# Altium project uZed_Breakout.PrjPcb
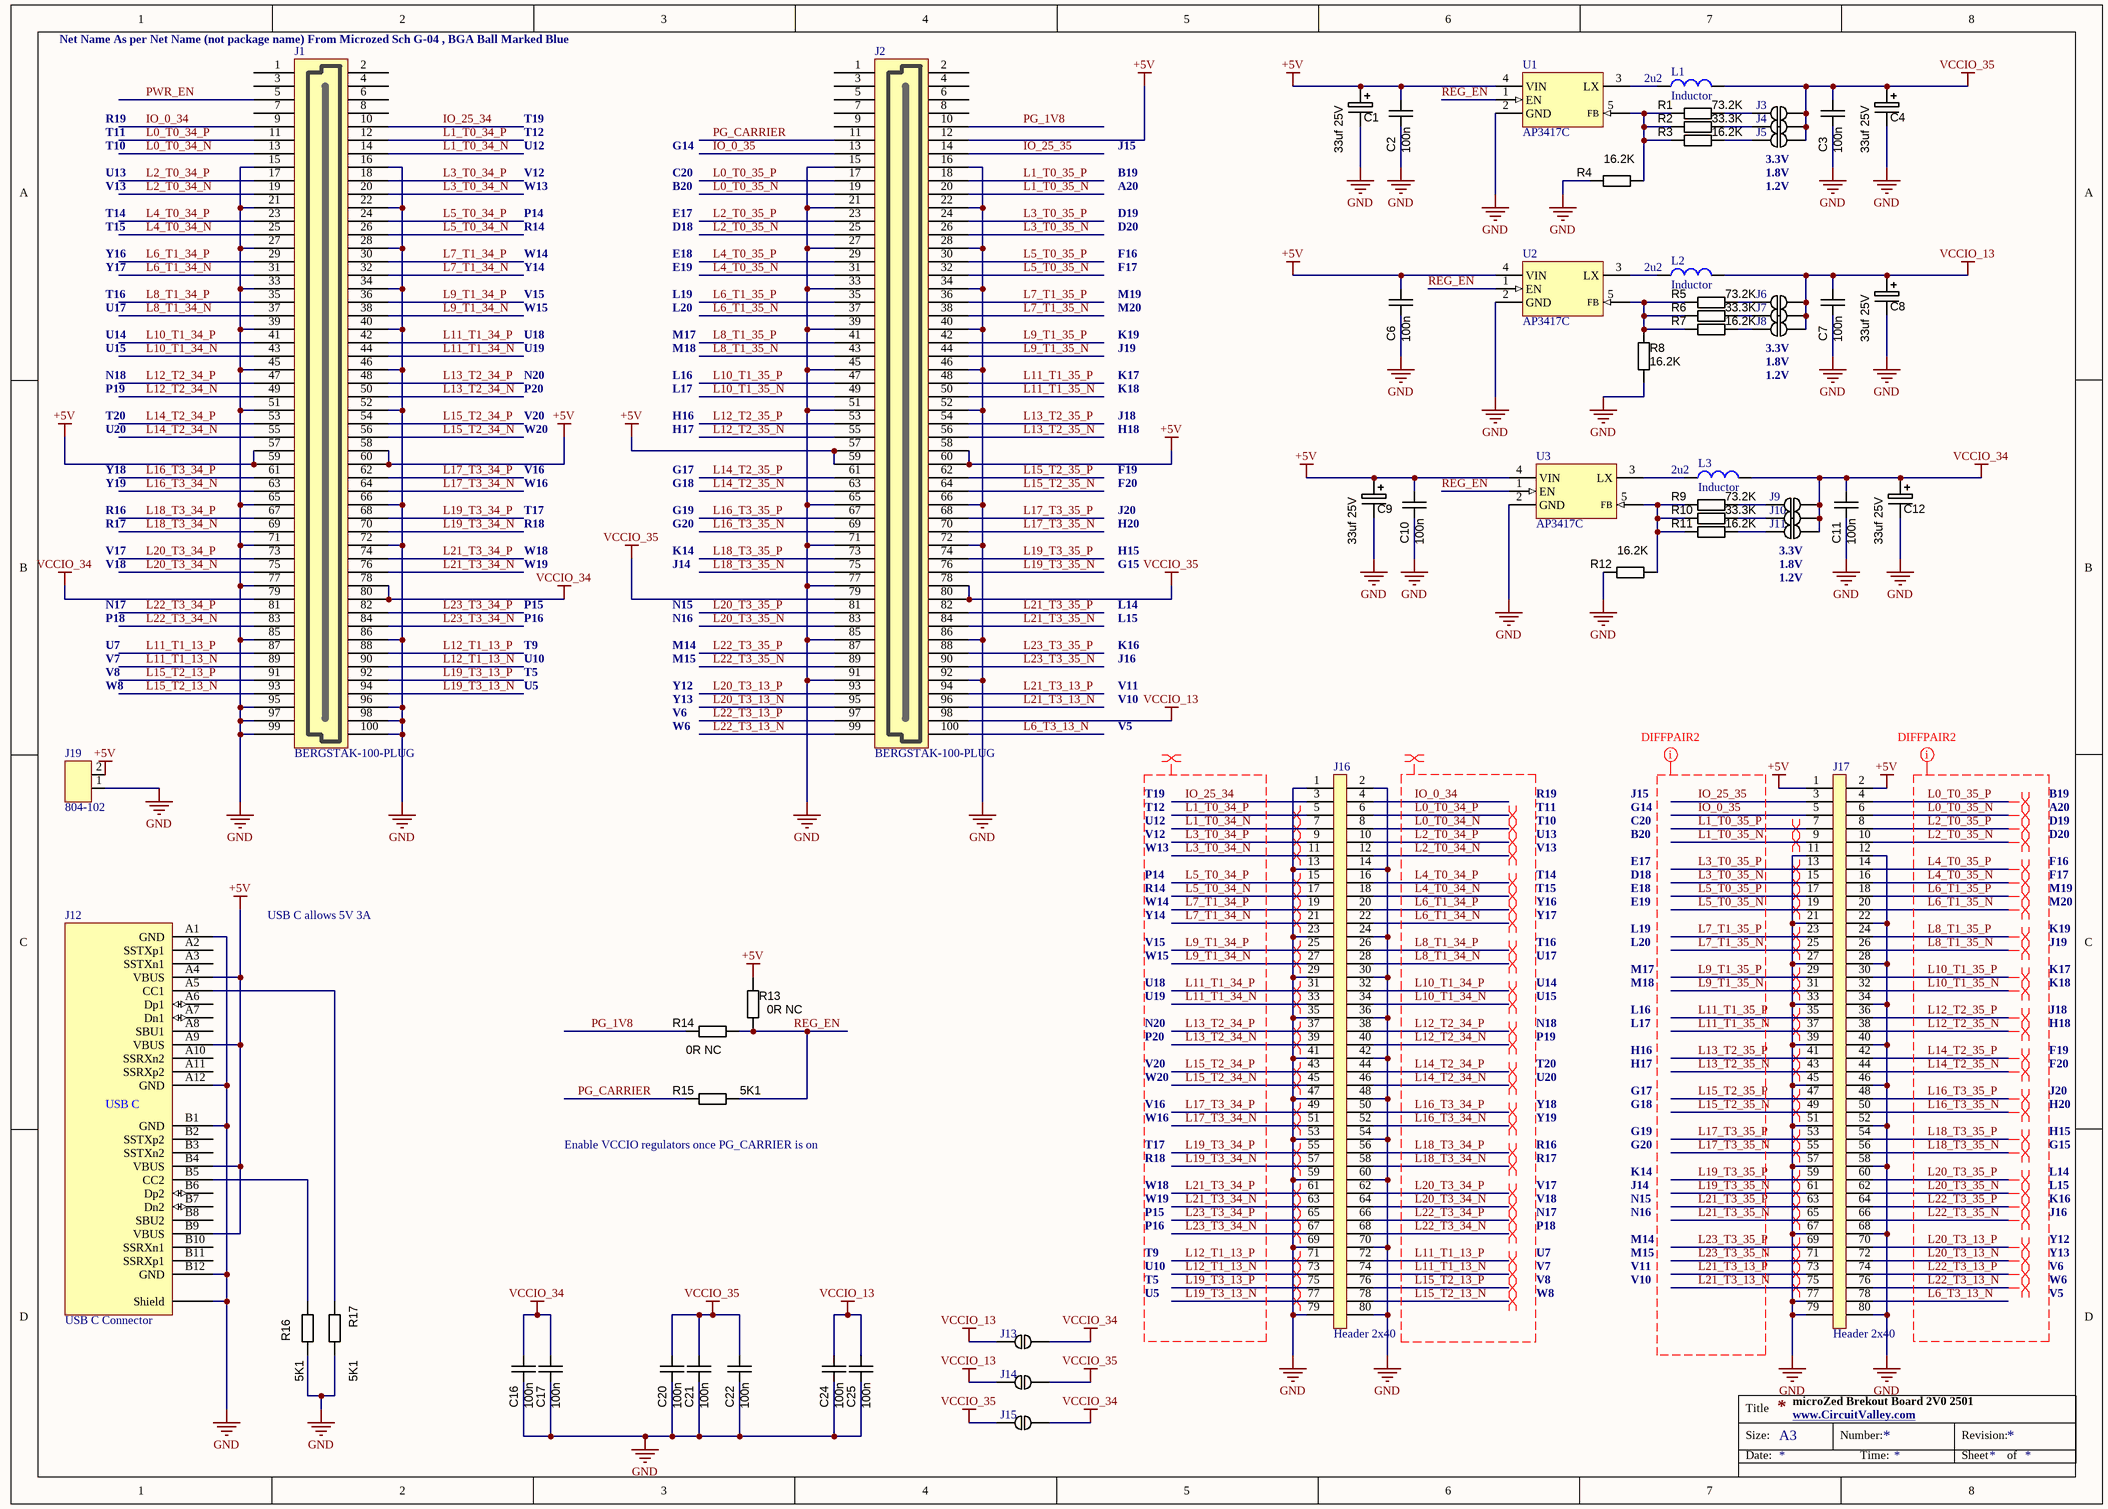
[diagram p0: uZed_breakout.SchDoc]
1 sheet, 59 parts. Net scope: global (net labels, ports and power ports of the same name join across sheets).
Board file: uZed_breakout.PcbDoc

## Sheet uZed_breakout.SchDoc
size A3

### Parts
C1  value 33uf 25V  [CAPMP7343X310N]  (hidden comment: 33uf 20V D)
C2  100n  [CAPC1608N]
C3  100n  [CAPC1608N]
C4  value 33uf 25V  [CAPMP7343X310N]  (hidden comment: 33uf 20V D)
C6  100n  [CAPC1608N]
C7  100n  [CAPC1608N]
C8  value 33uf 25V  [CAPMP7343X310N]  (hidden comment: 33uf 20V D)
C9  value 33uf 25V  [CAPMP7343X310N]  (hidden comment: 33uf 20V D)
C10  100n  [CAPC1608N]
C11  100n  [CAPC1608N]
C12  value 33uf 25V  [CAPMP7343X310N]  (hidden comment: 33uf 20V D)
C16  100n  [CAPC1608N]
C17  100n  [CAPC1608N]
C20  100n  [CAPC1608N]
C21  100n  [CAPC1608N]
C22  100n  [CAPC1608N]
C24  100n  [CAPC1608N]
C25  100n  [CAPC1608N]
J1  BERGSTAK-100-PLUG  [61083-101400LF]
J2  BERGSTAK-100-PLUG  [61083-101400LF]
J3  SMD Jumper  [SMD_Jumper]  (value not drawn)  (net tie, no BOM)
J4  SMD Jumper Bridged  [SMD_Jumper_bridge]  (value not drawn)  (net tie, no BOM)
J5  SMD Jumper  [SMD_Jumper]  (value not drawn)  (net tie, no BOM)
J6  SMD Jumper  [SMD_Jumper]  (value not drawn)  (net tie, no BOM)
J7  SMD Jumper Bridged  [SMD_Jumper_bridge]  (value not drawn)  (net tie, no BOM)
J8  SMD Jumper  [SMD_Jumper]  (value not drawn)  (net tie, no BOM)
J9  SMD Jumper  [SMD_Jumper]  (value not drawn)  (net tie, no BOM)
J10  SMD Jumper Bridged  [SMD_Jumper_bridge]  (value not drawn)  (net tie, no BOM)
J11  SMD Jumper  [SMD_Jumper]  (value not drawn)  (net tie, no BOM)
J12  USB C Connector  [UT11113-11602-7H]
J13  SMD Jumper  [SMD_Jumper]  (value not drawn)  (net tie, no BOM)
J14  SMD Jumper  [SMD_Jumper]  (value not drawn)  (net tie, no BOM)
J15  SMD Jumper  [SMD_Jumper]  (value not drawn)  (net tie, no BOM)
J16  Header 2x40  [Header_2x40]
J17  Header 2x40  [Header_2x40]
J19  804-102  [804-102]
L1  Inductor  value 2u2  [SFE4018A-2R2M-F-HF]
L2  Inductor  value 2u2  [SFE4018A-2R2M-F-HF]
L3  Inductor  value 2u2  [SFE4018A-2R2M-F-HF]
R1  value 73.2K  [RESC1608N_ZERO]  (hidden comment: Thick Film)
R2  value 33.3K  [RESC1608N_ZERO]  (hidden comment: Thick Film)
R3  value 16.2K  [RESC1608N_ZERO]  (hidden comment: Thick Film)
R4  value 16.2K  [RESC1608N_ZERO]  (hidden comment: Thick Film)
R5  value 73.2K  [RESC1608N_ZERO]  (hidden comment: Thick Film)
R6  value 33.3K  [RESC1608N_ZERO]  (hidden comment: Thick Film)
R7  value 16.2K  [RESC1608N_ZERO]  (hidden comment: Thick Film)
R8  value 16.2K  [RESC1608N_ZERO]  (hidden comment: Thick Film)
R9  value 73.2K  [RESC1608N_ZERO]  (hidden comment: Thick Film)
R10  value 33.3K  [RESC1608N_ZERO]  (hidden comment: Thick Film)
R11  value 16.2K  [RESC1608N_ZERO]  (hidden comment: Thick Film)
R12  value 16.2K  [RESC1608N_ZERO]  (hidden comment: Thick Film)
R13  value 0R NC  [RESC1608N_ZERO]  (hidden comment: Thick Film)
R14  value 0R NC  [RESC1608N_ZERO]  (hidden comment: Thick Film)
R15  value 5K1  [RESC1608N_ZERO]  (hidden comment: Thick Film)
R16  value 5K1  [RESC1608N_ZERO]  (hidden comment: Thick Film)
R17  value 5K1  [RESC1608N_ZERO]  (hidden comment: Thick Film)
U1  AP3417C  [SOT23-5]
U2  AP3417C  [SOT23-5]
U3  AP3417C  [SOT23-5]

### Nets
+5V: C1.1 C2.2 C6.2 C9.1 C10.2 J1.57 J1.58 J1.59 J1.60 J2.12 J2.57 J2.58 J2.59 J2.60 J12.A4(VBUS) J12.A9(VBUS) J12.B4(VBUS) J12.B9(VBUS) J17.1 J17.2 J19.2(PW) R13.1 U1.4(VIN) U2.4(VIN) U3.4(VIN)
GND: C1.2 C2.1 C3.1 C4.2 C6.1 C7.1 C8.2 C9.2 C10.1 C11.1 C12.2 C16.1 C17.1 C20.1 C21.1 C22.1 C24.1 C25.1 J1.15 J1.16 J1.21 J1.22 J1.27 J1.28 J1.33 J1.34 J1.39 J1.40 J1.45 J1.46 J1.51 J1.52 J1.65 J1.66 J1.71 J1.72 J1.77 J1.85 J1.86 J1.95 J1.96 J1.97 J1.98 J1.99 J1.100 J2.15 J2.16 J2.21 J2.22 J2.27 J2.28 J2.33 J2.34 J2.39 J2.40 J2.45 J2.46 J2.51 J2.52 J2.65 J2.66 J2.71 J2.72 J2.77 J2.85 J2.86 J2.91 J2.92 J12.0(Shield) J12.A1(GND) J12.A12(GND) J12.B1(GND) J12.B12(GND) J16.1 J16.2 J16.13 J16.14 J16.23 J16.24 J16.29 J16.30 J16.35 J16.36 J16.41 J16.42 J16.47 J16.48 J16.53 J16.54 J16.59 J16.60 J16.69 J16.70 J16.79 J16.80 J17.11 J17.12 J17.21 J17.22 J17.27 J17.28 J17.33 J17.34 J17.39 J17.40 J17.45 J17.46 J17.51 J17.52 J17.57 J17.58 J17.67 J17.68 J17.77 J17.79 J17.80 J19.1(PW) R4.2 R8.1 R12.2 R16.2 R17.2 U1.2(GND) U2.2(GND) U3.2(GND)
VCCIO_13: C7.2 C8.1 C24.2 C25.2 J2.98 J6.1 J7.1 J8.1 J13.2 J14.2 L2.2
VCCIO_34: C11.2 C12.1 C16.2 C17.2 J1.78 J1.79 J1.80 J9.1 J10.1 J11.1 J13.1 J15.1 L3.2
VCCIO_35: C3.2 C4.1 C20.2 C21.2 C22.2 J2.78 J2.79 J2.80 J3.1 J4.1 J5.1 J14.1 J15.2 L1.2
IO_0_34: J1.9 J16.4
IO_0_35: J2.13 J17.5
IO_25_34: J1.10 J16.3
IO_25_35: J2.14 J17.3
L0_T0_34_N: J1.13 J16.8
L0_T0_34_P: J1.11 J16.6
L0_T0_35_N: J2.19 J17.6
L0_T0_35_P: J2.17 J17.4
L1_T0_34_N: J1.14 J16.7
L1_T0_34_P: J1.12 J16.5
L1_T0_35_N: J2.20 J17.9
L1_T0_35_P: J2.18 J17.7
L2_T0_34_N: J1.19 J16.12
L2_T0_34_P: J1.17 J16.10
L2_T0_35_N: J2.25 J17.10
L2_T0_35_P: J2.23 J17.8
L3_T0_34_N: J1.20 J16.11
L3_T0_34_P: J1.18 J16.9
L3_T0_35_N: J2.26 J17.15
L3_T0_35_P: J2.24 J17.13
L4_T0_34_N: J1.25 J16.18
L4_T0_34_P: J1.23 J16.16
L4_T0_35_N: J2.31 J17.16
L4_T0_35_P: J2.29 J17.14
L5_T0_34_N: J1.26 J16.17
L5_T0_34_P: J1.24 J16.15
L5_T0_35_N: J2.32 J17.19
L5_T0_35_P: J2.30 J17.17
L6_T1_34_N: J1.31 J16.22
L6_T1_34_P: J1.29 J16.20
L6_T1_35_N: J2.37 J17.20
L6_T1_35_P: J2.35 J17.18
L6_T3_13_N: J2.100 J17.78
L7_T1_34_N: J1.32 J16.21
L7_T1_34_P: J1.30 J16.19
L7_T1_35_N: J2.38 J17.25
L7_T1_35_P: J2.36 J17.23
L8_T1_34_N: J1.37 J16.28
L8_T1_34_P: J1.35 J16.26
L8_T1_35_N: J2.43 J17.26
L8_T1_35_P: J2.41 J17.24
L9_T1_34_N: J1.38 J16.27
L9_T1_34_P: J1.36 J16.25
L9_T1_35_N: J2.44 J17.31
L9_T1_35_P: J2.42 J17.29
L10_T1_34_N: J1.43 J16.34
L10_T1_34_P: J1.41 J16.32
L10_T1_35_N: J2.49 J17.32
L10_T1_35_P: J2.47 J17.30
L11_T1_13_N: J1.89 J16.74
L11_T1_13_P: J1.87 J16.72
L11_T1_34_N: J1.44 J16.33
L11_T1_34_P: J1.42 J16.31
L11_T1_35_N: J2.50 J17.37
L11_T1_35_P: J2.48 J17.35
L12_T1_13_N: J1.90 J16.73
L12_T1_13_P: J1.88 J16.71
L12_T2_34_N: J1.49 J16.40
L12_T2_34_P: J1.47 J16.38
L12_T2_35_N: J2.55 J17.38
L12_T2_35_P: J2.53 J17.36
L13_T2_34_N: J1.50 J16.39
L13_T2_34_P: J1.48 J16.37
L13_T2_35_N: J2.56 J17.43
L13_T2_35_P: J2.54 J17.41
L14_T2_34_N: J1.55 J16.46
L14_T2_34_P: J1.53 J16.44
L14_T2_35_N: J2.63 J17.44
L14_T2_35_P: J2.61 J17.42
L15_T2_13_N: J1.93 J16.78
L15_T2_13_P: J1.91 J16.76
L15_T2_34_N: J1.56 J16.45
L15_T2_34_P: J1.54 J16.43
L15_T2_35_N: J2.64 J17.49
L15_T2_35_P: J2.62 J17.47
L16_T3_34_N: J1.63 J16.52
L16_T3_34_P: J1.61 J16.50
L16_T3_35_N: J2.69 J17.50
L16_T3_35_P: J2.67 J17.48
L17_T3_34_N: J1.64 J16.51
L17_T3_34_P: J1.62 J16.49
L17_T3_35_N: J2.70 J17.55
L17_T3_35_P: J2.68 J17.53
L18_T3_34_N: J1.69 J16.58
L18_T3_34_P: J1.67 J16.56
L18_T3_35_N: J2.75 J17.56
L18_T3_35_P: J2.73 J17.54
L19_T3_13_N: J1.94 J16.77
L19_T3_13_P: J1.92 J16.75
L19_T3_34_N: J1.70 J16.57
L19_T3_34_P: J1.68 J16.55
L19_T3_35_N: J2.76 J17.61
L19_T3_35_P: J2.74 J17.59
L20_T3_13_N: J2.95 J17.72
L20_T3_13_P: J2.93 J17.70
L20_T3_34_N: J1.75 J16.64
L20_T3_34_P: J1.73 J16.62
L20_T3_35_N: J2.83 J17.62
L20_T3_35_P: J2.81 J17.60
L21_T3_13_N: J2.96 J17.75
L21_T3_13_P: J2.94 J17.73
L21_T3_34_N: J1.76 J16.63
L21_T3_34_P: J1.74 J16.61
L21_T3_35_N: J2.84 J17.65
L21_T3_35_P: J2.82 J17.63
L22_T3_13_N: J2.99 J17.76
L22_T3_13_P: J2.97 J17.74
L22_T3_34_N: J1.83 J16.68
L22_T3_34_P: J1.81 J16.66
L22_T3_35_N: J2.89 J17.66
L22_T3_35_P: J2.87 J17.64
L23_T3_34_N: J1.84 J16.67
L23_T3_34_P: J1.82 J16.65
L23_T3_35_N: J2.90 J17.71
L23_T3_35_P: J2.88 J17.69
PG_1V8: J2.10 R14.2
PG_CARRIER: J2.11 R15.2
PWR_EN: J1.5
REG_EN: R13.2 R14.1 R15.1 U1.1(EN) U2.1(EN) U3.1(EN)
NetJ3_2: J3.2 R1.1
NetJ4_2: J4.2 R2.1
NetJ5_2: J5.2 R3.1
NetJ6_2: J6.2 R5.2
NetJ7_2: J7.2 R6.2
NetJ8_2: J8.2 R7.2
NetJ9_2: J9.2 R9.1
NetJ10_2: J10.2 R10.1
NetJ11_2: J11.2 R11.1
NetJ12_A5: J12.A5(CC1) R17.1
NetJ12_B5: J12.B5(CC2) R16.1
NetL1_1: L1.1 U1.3(LX)
NetL2_1: L2.1 U2.3(LX)
NetL3_1: L3.1 U3.3(LX)
NetR1_2: R1.2 R2.2 R3.2 R4.1 U1.5(FB)
NetR5_1: R5.1 R6.1 R7.1 R8.2 U2.5(FB)
NetR9_2: R9.2 R10.2 R11.2 R12.1 U3.5(FB)

Not connected (* = marked no-connect by the designer): J1 1 2 3 4 6 7 8; J2 1 2 3 4 5 6 7 8 9; J12 A2(SSTXp1) A3(SSTXn1) A6(Dp1) A7(Dn1) A8(SBU1) A10(SSRXn2) A11(SSRXp2) B2(SSTXp2) B3(SSTXn2) B6(Dp2) B7(Dn2) B8(SBU2) B10(SSRXn1) B11(SSRXp1)

### Layout directives
differential pair: L0_T0_34_N, L0_T0_34_P, L0_T0_35_N, L0_T0_35_P, L1_T0_34_N, L1_T0_34_P, L1_T0_35_N, L1_T0_35_P, L2_T0_34_N, L2_T0_34_P, L2_T0_35_N, L2_T0_35_P, L3_T0_34_N, L3_T0_34_P, L3_T0_35_N, L3_T0_35_P, L4_T0_34_N, L4_T0_34_P, L4_T0_35_N, L4_T0_35_P, L5_T0_34_N, L5_T0_34_P, L5_T0_35_N, L5_T0_35_P, L6_T1_34_N, L6_T1_34_P, L6_T1_35_N, L6_T1_35_P, L7_T1_34_N, L7_T1_34_P, L7_T1_35_N, L7_T1_35_P, L8_T1_34_N, L8_T1_34_P, L8_T1_35_N, L8_T1_35_P, L9_T1_34_N, L9_T1_34_P, L9_T1_35_N, L9_T1_35_P, L10_T1_34_N, L10_T1_34_P, L10_T1_35_N, L10_T1_35_P, L11_T1_13_N, L11_T1_13_P, L11_T1_34_N, L11_T1_34_P, L11_T1_35_N, L11_T1_35_P, L12_T1_13_N, L12_T1_13_P, L12_T2_34_N, L12_T2_34_P, L12_T2_35_N, L12_T2_35_P, L13_T2_34_N, L13_T2_34_P, L13_T2_35_N, L13_T2_35_P, L14_T2_34_N, L14_T2_34_P, L14_T2_35_N, L14_T2_35_P, L15_T2_13_N, L15_T2_13_P, L15_T2_34_N, L15_T2_34_P, L15_T2_35_N, L15_T2_35_P, L16_T3_34_N, L16_T3_34_P, L16_T3_35_N, L16_T3_35_P, L17_T3_34_N, L17_T3_34_P, L17_T3_35_N, L17_T3_35_P, L18_T3_34_N, L18_T3_34_P, L18_T3_35_N, L18_T3_35_P, L19_T3_13_N, L19_T3_13_P, L19_T3_34_N, L19_T3_34_P, L19_T3_35_N, L19_T3_35_P, L20_T3_13_N, L20_T3_13_P, L20_T3_34_N, L20_T3_34_P, L20_T3_35_N, L20_T3_35_P, L21_T3_13_N, L21_T3_13_P, L21_T3_34_N, L21_T3_34_P, L21_T3_35_N, L21_T3_35_P, L22_T3_13_N, L22_T3_13_P, L22_T3_34_N, L22_T3_34_P, L22_T3_35_N, L22_T3_35_P, L23_T3_34_N, L23_T3_34_P, L23_T3_35_N, L23_T3_35_P
net class DIFFPAIR: IO_0_34, IO_25_34, L0_T0_34_N, L0_T0_34_P, L1_T0_34_N, L1_T0_34_P, L2_T0_34_N, L2_T0_34_P, L3_T0_34_N, L3_T0_34_P, L4_T0_34_N, L4_T0_34_P, L5_T0_34_N, L5_T0_34_P, L6_T1_34_N, L6_T1_34_P, L7_T1_34_N, L7_T1_34_P, L8_T1_34_N, L8_T1_34_P, L9_T1_34_N, L9_T1_34_P, L10_T1_34_N, L10_T1_34_P, L11_T1_13_N, L11_T1_13_P, L11_T1_34_N, L11_T1_34_P, L12_T1_13_N, L12_T1_13_P, L12_T2_34_N, L12_T2_34_P, L13_T2_34_N, L13_T2_34_P, L14_T2_34_N, L14_T2_34_P, L15_T2_13_N, L15_T2_13_P, L15_T2_34_N, L15_T2_34_P, L16_T3_34_N, L16_T3_34_P, L17_T3_34_N, L17_T3_34_P, L18_T3_34_N, L18_T3_34_P, L19_T3_13_N, L19_T3_13_P, L19_T3_34_N, L19_T3_34_P, L20_T3_34_N, L20_T3_34_P, L21_T3_34_N, L21_T3_34_P, L22_T3_34_N, L22_T3_34_P, L23_T3_34_N, L23_T3_34_P
net class DIFFPAIR2: IO_0_35, IO_25_35, L0_T0_35_N, L0_T0_35_P, L1_T0_35_N, L1_T0_35_P, L2_T0_35_N, L2_T0_35_P, L3_T0_35_N, L3_T0_35_P, L4_T0_35_N, L4_T0_35_P, L5_T0_35_N, L5_T0_35_P, L6_T1_35_N, L6_T1_35_P, L6_T3_13_N, L7_T1_35_N, L7_T1_35_P, L8_T1_35_N, L8_T1_35_P, L9_T1_35_N, L9_T1_35_P, L10_T1_35_N, L10_T1_35_P, L11_T1_35_N, L11_T1_35_P, L12_T2_35_N, L12_T2_35_P, L13_T2_35_N, L13_T2_35_P, L14_T2_35_N, L14_T2_35_P, L15_T2_35_N, L15_T2_35_P, L16_T3_35_N, L16_T3_35_P, L17_T3_35_N, L17_T3_35_P, L18_T3_35_N, L18_T3_35_P, L19_T3_35_N, L19_T3_35_P, L20_T3_13_N, L20_T3_13_P, L20_T3_35_N, L20_T3_35_P, L21_T3_13_N, L21_T3_13_P, L21_T3_35_N, L21_T3_35_P, L22_T3_13_N, L22_T3_13_P, L22_T3_35_N, L22_T3_35_P, L23_T3_35_N, L23_T3_35_P

### Notes on the sheet
- (near J1) Net Name As per Net Name (not package name) From Microzed Sch G-04 , BGA Ball Marked Blue
- R19
- T11
- T10
- U13
- T12
- U12
- V12
- T19
- C20
- G14
- B19
- J15
- (near J5) 3.3V
- 1.8V
- V13
- T14
- T15
- W13
- P14
- R14
- B20
- E17
- D18
- A20
- D19
- D20
- 1.2V
- Y16
- Y17
- T16
- U17
- W14
- Y14
- V15
- W15
- E18
- E19
- L19
- L20
- F16
- F17
- M19
- M20
- U14
- U15
- N18
- U18
- U19
- N20
- M17
- M18
- L16
- K19
- J19
- K17
- (near J8) 3.3V
- P19
- T20
- U20
- P20
- V20
- W20
- L17
- H16
- H17
- K18
- J18
- H18
- Y18
- Y19
- R16
- V16
- W16
- T17
- G17
- G18
- G19
- F19
- F20
- J20
- R17
- V17
- V18
- R18
- W18
- W19
- G20
- K14
- J14
- H20
- H15
- G15
- (near J11) 3.3V
- N17
- P18
- U7
- P15
- P16
- T9
- N15
- N16
- M14
- L14
- L15
- K16
- V7
- V8
- W8
- U10
- T5
- U5
- M15
- Y12
- Y13
- V6
- J16
- V11
- V10
- W6
- V5
- USB C allows 5V 3A
- (near R15) Enable VCCIO regulators once PG_CARRIER is on
- microZed Brekout Board 2V0 2501
- www.CircuitValley.com <http://www.CircuitValley.com>
- Title
- Size:
- Date:
- A3
- Number:
- Time:
- Revision:
- Sheet
- of
- (in symbol USB_C) USB C

### Library data of the parts
C1 C4 C8 C9 C12 = CAPT_330u_2917_6V3: Capacitor SMD Tant 330uF 20% 6V3 2917; Manufacturer Part Number: T520D337M006ATE015; Part: TAJD336K020R; Ratings: 6.3V; Material: Solid Tantalum; ESR (Equivalent Series Resistance): 15 mOhm; Package / Case: 2917 (7343 Metric); Tolerance: ±20%; Operating Temperature: -55°C ~ 125°C; Size / Dimension: 0.287" L x 0.169" W (7.30mm x 4.30mm); Height - Seated (Max): 0.122" (3.10mm); Manufacturer Size Code: D; Supplier 1: Digi-Key; Supplier Part Number 1: 399-4052-1-ND; ComponentLink1URL: http://www.kemet.com/datasheets&T520D337M006ATE015; ComponentLink1Description: T520D Datasheet
C2 C3 C6 C7 C10 C11 C16 C17 C20-C22 C24 C25 = CAPC_10p_0603_NP0_1%_50V: Capacitor SMD Cer 10pF 5% 50V NP0 0603; Manufacturer 1: Murata Electronics North America; Manufacturer Part Number 1: GRM1885C1H100FA01J; Part: C0603X104K5RAC; Ratings: 50V; NP0; Tolerance: ±5%; Operating Temperature: -55°C ~ 125°C; Package / Case: 0603 (1608 Metric); Size / Dimension: 0.063" L x 0.032" W (1.60mm x 0.81mm); Thickness (Max): 0.035" (0.90mm); Supplier 1: Digi-Key; Supplier Part Number 1: GRM1885C1H100FA01J-ND; Value: 100n
J3 J5 J6 J8 J9 J11 J13-J15 = SMD_Jumper
J4 J7 J10 = SMD_Jumper_Bridged: SMD Jumper
J12 = USB_C
J16 J17 = Header_2x40
L1-L3 = inductor_smd
R1-R17 = RES_0R_0603: Resistor SMD chip 0.0 Ohm 0.1W 0603; Manufacturer 1: Vishay/Dale; Manufacturer Part Number 1: CRCW06030000Z0EA; Tolerance: ±5%; Ratings: 1/10W; Package / Case: 0603 (1608metric); Supplier 1: Digi-Key; Supplier Part Number 1: 541-0.0GCT-ND
J19 = 804-102: Part: 804-102